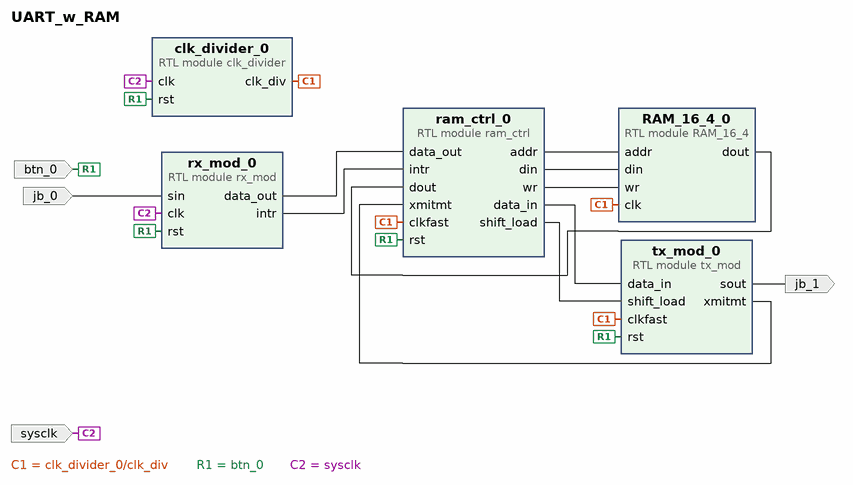
[diagram p0: block diagram of the top level]
# Vivado block design UART_w_RAM, xc7z020clg400-1, Vivado 2025.2
create_bd_design UART_w_RAM

create_bd_port -dir O jb_1
create_bd_port -dir I jb_0
create_bd_port -dir I -type clk sysclk
set_property -dict {CONFIG.FREQ_HZ 100000000} [get_bd_ports sysclk]
create_bd_port -dir I -type rst btn_0

create_bd_cell -type module -reference clk_divider clk_divider_0
create_bd_cell -type module -reference tx_mod tx_mod_0
create_bd_cell -type module -reference rx_mod rx_mod_0
create_bd_cell -type module -reference RAM_16_4 RAM_16_4_0
create_bd_cell -type module -reference ram_ctrl ram_ctrl_0

# ---- connections ----

connect_bd_net [get_bd_pins RAM_16_4_0/dout] [get_bd_pins ram_ctrl_0/dout]
connect_bd_net [get_bd_pins clk_divider_0/clk_div] [get_bd_pins tx_mod_0/clkfast] [get_bd_pins ram_ctrl_0/clkfast] [get_bd_pins RAM_16_4_0/clk]
connect_bd_net [get_bd_pins ram_ctrl_0/addr] [get_bd_pins RAM_16_4_0/addr]
connect_bd_net [get_bd_pins ram_ctrl_0/data_in] [get_bd_pins tx_mod_0/data_in]
connect_bd_net [get_bd_pins ram_ctrl_0/din] [get_bd_pins RAM_16_4_0/din]
connect_bd_net [get_bd_pins ram_ctrl_0/shift_load] [get_bd_pins tx_mod_0/shift_load]
connect_bd_net [get_bd_pins ram_ctrl_0/wr] [get_bd_pins RAM_16_4_0/wr]
connect_bd_net -net rst_1 [get_bd_ports btn_0] \
  [get_bd_pins rx_mod_0/rst] [get_bd_pins clk_divider_0/rst] [get_bd_pins ram_ctrl_0/rst] [get_bd_pins tx_mod_0/rst]
connect_bd_net [get_bd_pins rx_mod_0/data_out] [get_bd_pins ram_ctrl_0/data_out]
connect_bd_net [get_bd_pins rx_mod_0/intr] [get_bd_pins ram_ctrl_0/intr]
connect_bd_net -net sin_1 [get_bd_ports jb_0] [get_bd_pins rx_mod_0/sin]
connect_bd_net [get_bd_ports sysclk] [get_bd_pins clk_divider_0/clk] [get_bd_pins rx_mod_0/clk]
connect_bd_net [get_bd_pins tx_mod_0/sout] [get_bd_ports jb_1]
connect_bd_net [get_bd_pins tx_mod_0/xmitmt] [get_bd_pins ram_ctrl_0/xmitmt]

validate_bd_design
save_bd_design
